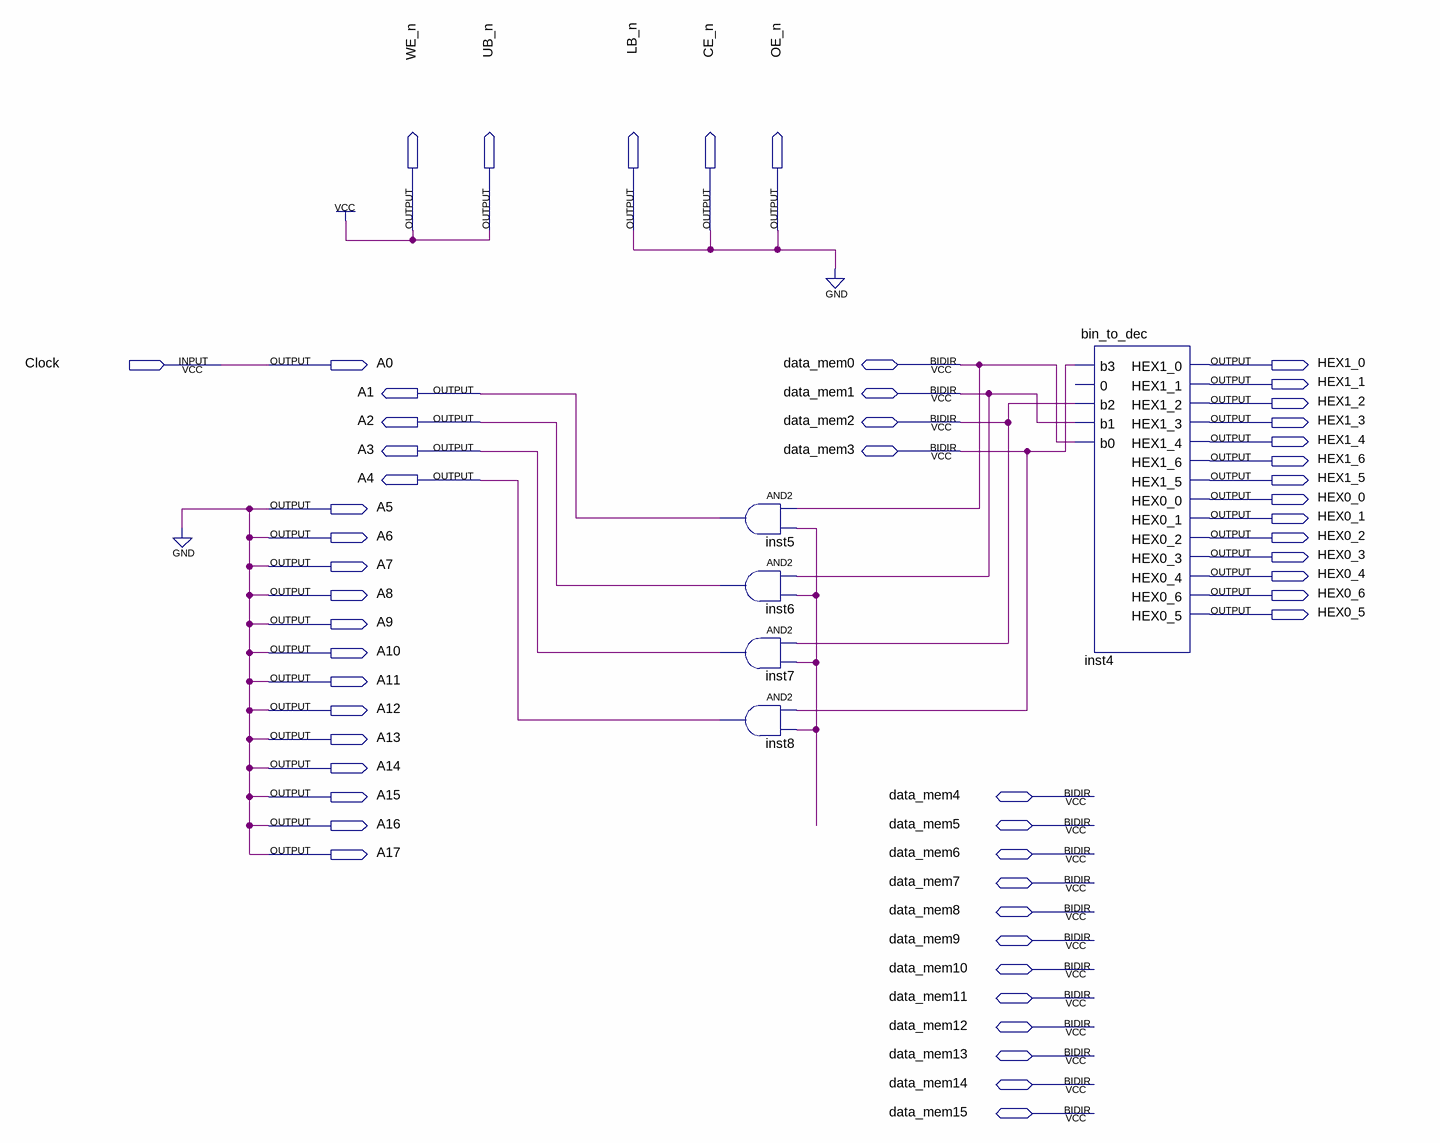
[diagram p0: schematic sheet]
// Quartus schematic SRAMcounter.bdf as structural Verilog: 5 symbols, 54 pins
module SRAMcounter (
  input  Clock,
  inout  data_mem0,
  inout  data_mem1,
  inout  data_mem2,
  inout  data_mem3,
  inout  data_mem4,
  inout  data_mem5,
  inout  data_mem6,
  inout  data_mem7,
  inout  data_mem8,
  inout  data_mem9,
  inout  data_mem10,
  inout  data_mem11,
  inout  data_mem12,
  inout  data_mem13,
  inout  data_mem14,
  inout  data_mem15,
  output WE_n,
  output UB_n,
  output LB_n,
  output CE_n,
  output OE_n,
  output A0,
  output HEX1_0,
  output HEX1_1,
  output A1,
  output HEX1_2,
  output A2,
  output HEX1_3,
  output HEX1_4,
  output A3,
  output HEX1_6,
  output A4,
  output HEX1_5,
  output HEX0_0,
  output A5,
  output HEX0_1,
  output A6,
  output HEX0_2,
  output HEX0_3,
  output A7,
  output HEX0_4,
  output A8,
  output HEX0_6,
  output HEX0_5,
  output A9,
  output A10,
  output A11,
  output A12,
  output A13,
  output A14,
  output A15,
  output A16,
  output A17
);

  wire undriven;

  and inst5 (A1, data_mem0, undriven);
  and inst6 (A2, data_mem1, undriven);
  and inst7 (A3, data_mem2, undriven);
  and inst8 (A4, data_mem3, undriven);
  bin_to_dec inst4 (
    .b3(data_mem3), .b2(data_mem2), .b1(data_mem1), .b0(data_mem0), .HEX1_0(HEX1_0), .HEX1_1(HEX1_1),
    .HEX1_2(HEX1_2), .HEX1_3(HEX1_3), .HEX1_4(HEX1_4), .HEX1_6(HEX1_6), .HEX1_5(HEX1_5), .HEX0_0(HEX0_0),
    .HEX0_1(HEX0_1), .HEX0_2(HEX0_2), .HEX0_3(HEX0_3), .HEX0_4(HEX0_4), .HEX0_6(HEX0_6), .HEX0_5(HEX0_5));  // open: 0

  assign A0 = Clock;
  assign A5 = 1'b0;
  assign A6 = 1'b0;
  assign A7 = 1'b0;
  assign A8 = 1'b0;
  assign A9 = 1'b0;
  assign A10 = 1'b0;
  assign A11 = 1'b0;
  assign A12 = 1'b0;
  assign A13 = 1'b0;
  assign A14 = 1'b0;
  assign A15 = 1'b0;
  assign A16 = 1'b0;
  assign A17 = 1'b0;
  assign CE_n = 1'b0;
  assign LB_n = 1'b0;
  assign OE_n = 1'b0;
  assign UB_n = 1'b1;
  assign WE_n = 1'b1;
endmodule
